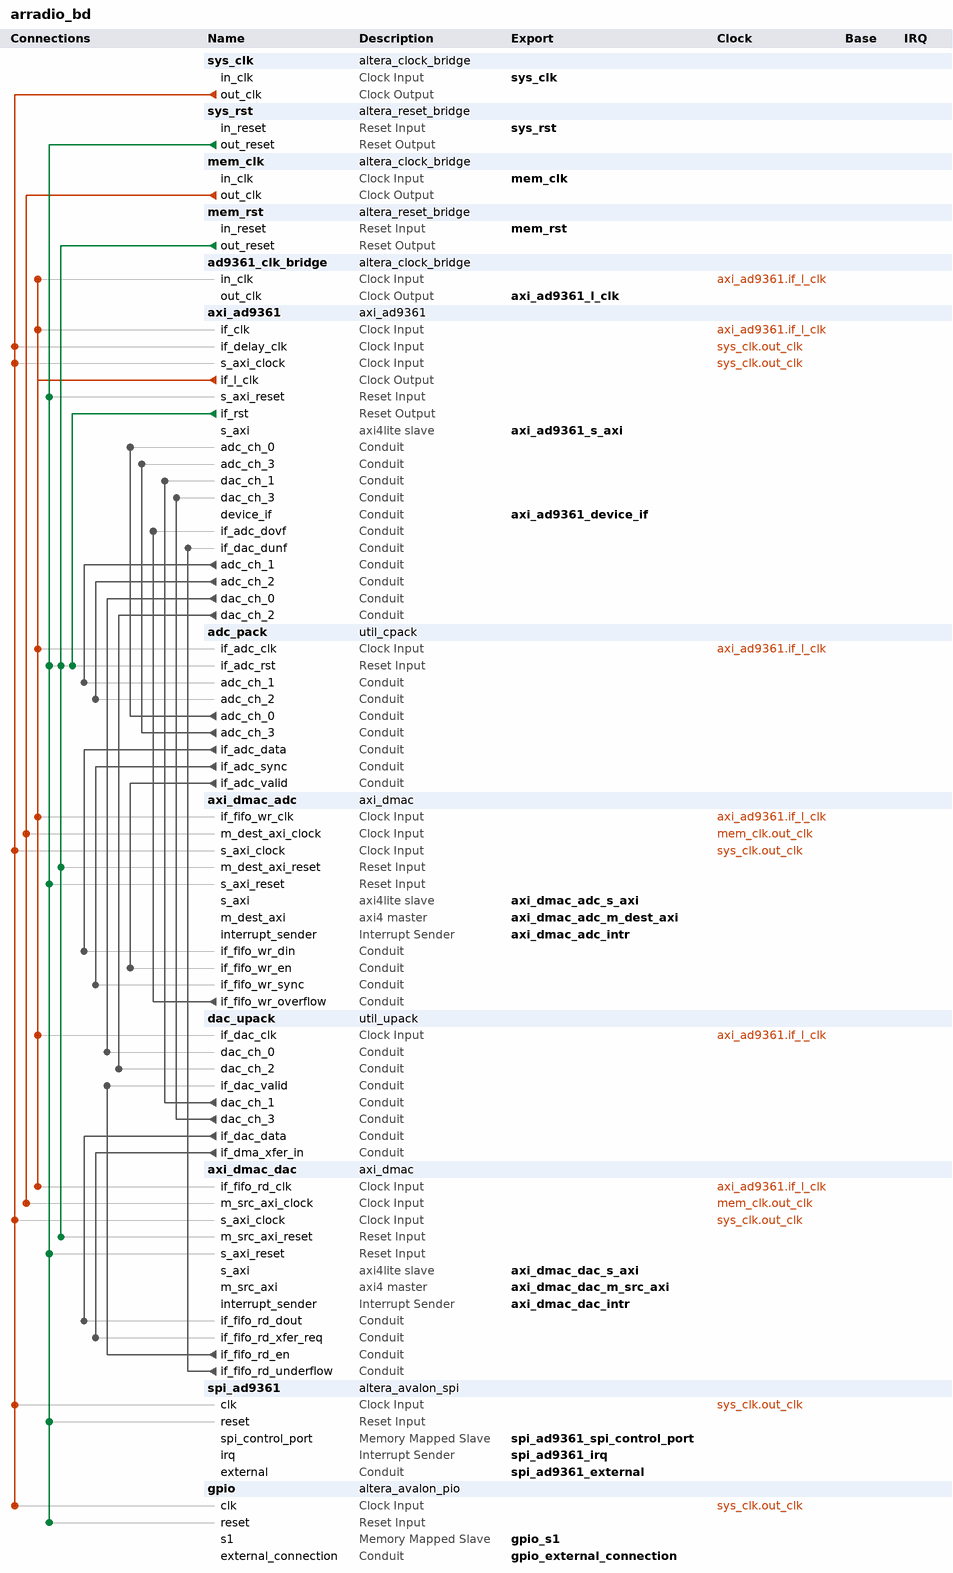
[diagram p0: system contents]
# Platform Designer (Qsys) system arradio_bd, Cyclone V 5CSXFC6D6F31C8ES
# Parameters at their usual value, and those the tool derives, are not listed.
package require -exact qsys 16.0
create_system arradio_bd
set_project_property DEVICE_FAMILY {Cyclone V}
set_project_property DEVICE 5CSXFC6D6F31C8ES

add_instance sys_clk altera_clock_bridge 16.0
set_instance_parameter_value sys_clk DERIVED_CLOCK_RATE 0
set_instance_parameter_value sys_clk EXPLICIT_CLOCK_RATE 50000000

add_instance sys_rst altera_reset_bridge 16.0
set_instance_parameter_value sys_rst ACTIVE_LOW_RESET 0
set_instance_parameter_value sys_rst SYNCHRONOUS_EDGES none

add_instance mem_clk altera_clock_bridge 16.0
set_instance_parameter_value mem_clk DERIVED_CLOCK_RATE 0
set_instance_parameter_value mem_clk EXPLICIT_CLOCK_RATE 0

add_instance mem_rst altera_reset_bridge 16.0
set_instance_parameter_value mem_rst ACTIVE_LOW_RESET 0
set_instance_parameter_value mem_rst SYNCHRONOUS_EDGES none

add_instance ad9361_clk_bridge altera_clock_bridge 16.0
set_instance_parameter_value ad9361_clk_bridge DERIVED_CLOCK_RATE 0
set_instance_parameter_value ad9361_clk_bridge EXPLICIT_CLOCK_RATE 0

add_instance axi_ad9361 axi_ad9361 1.0
set_instance_parameter_value axi_ad9361 ADC_DATAFORMAT_DISABLE 0
set_instance_parameter_value axi_ad9361 ADC_DATAPATH_DISABLE 0
set_instance_parameter_value axi_ad9361 ADC_DCFILTER_DISABLE 0
set_instance_parameter_value axi_ad9361 ADC_IQCORRECTION_DISABLE 0
set_instance_parameter_value axi_ad9361 ADC_USERPORTS_DISABLE 0
set_instance_parameter_value axi_ad9361 CMOS_OR_LVDS_N 0
set_instance_parameter_value axi_ad9361 DAC_DATAPATH_DISABLE 0
set_instance_parameter_value axi_ad9361 DAC_DDS_DISABLE 0
set_instance_parameter_value axi_ad9361 DAC_IODELAY_ENABLE 0
set_instance_parameter_value axi_ad9361 DAC_IQCORRECTION_DISABLE 0
set_instance_parameter_value axi_ad9361 DAC_USERPORTS_DISABLE 0
set_instance_parameter_value axi_ad9361 DEVICE_TYPE 0
set_instance_parameter_value axi_ad9361 ID 0
set_instance_parameter_value axi_ad9361 IO_DELAY_GROUP dev_if_delay_group
set_instance_parameter_value axi_ad9361 MODE_1R1T 0
set_instance_parameter_value axi_ad9361 TDD_DISABLE 0

add_instance adc_pack util_cpack 1.0
set_instance_parameter_value adc_pack CHANNEL_DATA_WIDTH 16
set_instance_parameter_value adc_pack NUM_OF_CHANNELS 4

add_instance axi_dmac_adc axi_dmac 1.0
set_instance_parameter_value axi_dmac_adc ASYNC_CLK_DEST_REQ 1
set_instance_parameter_value axi_dmac_adc ASYNC_CLK_REQ_SRC 1
set_instance_parameter_value axi_dmac_adc ASYNC_CLK_SRC_DEST 1
set_instance_parameter_value axi_dmac_adc AXI_SLICE_DEST 0
set_instance_parameter_value axi_dmac_adc AXI_SLICE_SRC 0
set_instance_parameter_value axi_dmac_adc CYCLIC 0
set_instance_parameter_value axi_dmac_adc DMA_2D_TRANSFER 0
set_instance_parameter_value axi_dmac_adc DMA_DATA_WIDTH_DEST 64
set_instance_parameter_value axi_dmac_adc DMA_DATA_WIDTH_SRC 64
set_instance_parameter_value axi_dmac_adc DMA_LENGTH_WIDTH 24
set_instance_parameter_value axi_dmac_adc DMA_TYPE_DEST 0
set_instance_parameter_value axi_dmac_adc DMA_TYPE_SRC 2
set_instance_parameter_value axi_dmac_adc FIFO_SIZE 4
set_instance_parameter_value axi_dmac_adc ID 0
set_instance_parameter_value axi_dmac_adc SYNC_TRANSFER_START 1

add_instance dac_upack util_upack 1.0
set_instance_parameter_value dac_upack CHANNEL_DATA_WIDTH 16
set_instance_parameter_value dac_upack NUM_OF_CHANNELS 4

add_instance axi_dmac_dac axi_dmac 1.0
set_instance_parameter_value axi_dmac_dac ASYNC_CLK_DEST_REQ 1
set_instance_parameter_value axi_dmac_dac ASYNC_CLK_REQ_SRC 1
set_instance_parameter_value axi_dmac_dac ASYNC_CLK_SRC_DEST 1
set_instance_parameter_value axi_dmac_dac AXI_SLICE_DEST 0
set_instance_parameter_value axi_dmac_dac AXI_SLICE_SRC 0
set_instance_parameter_value axi_dmac_dac CYCLIC 1
set_instance_parameter_value axi_dmac_dac DMA_2D_TRANSFER 0
set_instance_parameter_value axi_dmac_dac DMA_DATA_WIDTH_DEST 64
set_instance_parameter_value axi_dmac_dac DMA_DATA_WIDTH_SRC 64
set_instance_parameter_value axi_dmac_dac DMA_LENGTH_WIDTH 24
set_instance_parameter_value axi_dmac_dac DMA_TYPE_DEST 2
set_instance_parameter_value axi_dmac_dac DMA_TYPE_SRC 0
set_instance_parameter_value axi_dmac_dac FIFO_SIZE 4
set_instance_parameter_value axi_dmac_dac ID 0
set_instance_parameter_value axi_dmac_dac SYNC_TRANSFER_START 0

add_instance spi_ad9361 altera_avalon_spi 16.0
set_instance_parameter_value spi_ad9361 clockPolarity 1
set_instance_parameter_value spi_ad9361 dataWidth 8
set_instance_parameter_value spi_ad9361 masterSPI true
set_instance_parameter_value spi_ad9361 numberOfSlaves 1
set_instance_parameter_value spi_ad9361 targetClockRate 50000000

add_instance gpio altera_avalon_pio 16.0
set_instance_parameter_value gpio direction Output
set_instance_parameter_value gpio width 5

# connections
add_connection axi_ad9361.if_l_clk ad9361_clk_bridge.in_clk clock
add_connection axi_ad9361.if_l_clk adc_pack.if_adc_clk clock
add_connection axi_ad9361.if_l_clk axi_ad9361.if_clk clock
add_connection axi_ad9361.if_l_clk axi_dmac_adc.if_fifo_wr_clk clock
add_connection axi_ad9361.if_l_clk axi_dmac_dac.if_fifo_rd_clk clock
add_connection axi_ad9361.if_l_clk dac_upack.if_dac_clk clock
add_connection mem_clk.out_clk axi_dmac_adc.m_dest_axi_clock clock
add_connection mem_clk.out_clk axi_dmac_dac.m_src_axi_clock clock
add_connection sys_clk.out_clk axi_ad9361.if_delay_clk clock
add_connection sys_clk.out_clk axi_ad9361.s_axi_clock clock
add_connection sys_clk.out_clk axi_dmac_adc.s_axi_clock clock
add_connection sys_clk.out_clk axi_dmac_dac.s_axi_clock clock
add_connection sys_clk.out_clk gpio.clk clock
add_connection sys_clk.out_clk spi_ad9361.clk clock
add_connection axi_ad9361.if_rst adc_pack.if_adc_rst reset
add_connection mem_rst.out_reset adc_pack.if_adc_rst reset
add_connection mem_rst.out_reset axi_dmac_adc.m_dest_axi_reset reset
add_connection mem_rst.out_reset axi_dmac_dac.m_src_axi_reset reset
add_connection sys_rst.out_reset adc_pack.if_adc_rst reset
add_connection sys_rst.out_reset axi_ad9361.s_axi_reset reset
add_connection sys_rst.out_reset axi_dmac_adc.s_axi_reset reset
add_connection sys_rst.out_reset axi_dmac_dac.s_axi_reset reset
add_connection sys_rst.out_reset gpio.reset reset
add_connection sys_rst.out_reset spi_ad9361.reset reset
add_connection adc_pack.adc_ch_0 axi_ad9361.adc_ch_0 conduit
add_connection adc_pack.adc_ch_3 axi_ad9361.adc_ch_3 conduit
add_connection adc_pack.if_adc_data axi_dmac_adc.if_fifo_wr_din conduit
add_connection adc_pack.if_adc_sync axi_dmac_adc.if_fifo_wr_sync conduit
add_connection adc_pack.if_adc_valid axi_dmac_adc.if_fifo_wr_en conduit
add_connection axi_ad9361.adc_ch_1 adc_pack.adc_ch_1 conduit
add_connection axi_ad9361.adc_ch_2 adc_pack.adc_ch_2 conduit
add_connection axi_ad9361.dac_ch_0 dac_upack.dac_ch_0 conduit
add_connection axi_ad9361.dac_ch_2 dac_upack.dac_ch_2 conduit
add_connection axi_dmac_adc.if_fifo_wr_overflow axi_ad9361.if_adc_dovf conduit
add_connection axi_dmac_dac.if_fifo_rd_en dac_upack.if_dac_valid conduit
add_connection axi_dmac_dac.if_fifo_rd_underflow axi_ad9361.if_dac_dunf conduit
add_connection dac_upack.dac_ch_1 axi_ad9361.dac_ch_1 conduit
add_connection dac_upack.dac_ch_3 axi_ad9361.dac_ch_3 conduit
add_connection dac_upack.if_dac_data axi_dmac_dac.if_fifo_rd_dout conduit
add_connection dac_upack.if_dma_xfer_in axi_dmac_dac.if_fifo_rd_xfer_req conduit

# exported interfaces
add_interface axi_ad9361_device_if conduit end
set_interface_property axi_ad9361_device_if EXPORT_OF axi_ad9361.device_if
add_interface axi_ad9361_l_clk clock source
set_interface_property axi_ad9361_l_clk EXPORT_OF ad9361_clk_bridge.out_clk
add_interface axi_ad9361_s_axi axi4lite slave
set_interface_property axi_ad9361_s_axi EXPORT_OF axi_ad9361.s_axi
add_interface axi_dmac_adc_intr interrupt sender
set_interface_property axi_dmac_adc_intr EXPORT_OF axi_dmac_adc.interrupt_sender
add_interface axi_dmac_adc_m_dest_axi axi4 master
set_interface_property axi_dmac_adc_m_dest_axi EXPORT_OF axi_dmac_adc.m_dest_axi
add_interface axi_dmac_adc_s_axi axi4lite slave
set_interface_property axi_dmac_adc_s_axi EXPORT_OF axi_dmac_adc.s_axi
add_interface axi_dmac_dac_intr interrupt sender
set_interface_property axi_dmac_dac_intr EXPORT_OF axi_dmac_dac.interrupt_sender
add_interface axi_dmac_dac_m_src_axi axi4 master
set_interface_property axi_dmac_dac_m_src_axi EXPORT_OF axi_dmac_dac.m_src_axi
add_interface axi_dmac_dac_s_axi axi4lite slave
set_interface_property axi_dmac_dac_s_axi EXPORT_OF axi_dmac_dac.s_axi
add_interface gpio_external_connection conduit end
set_interface_property gpio_external_connection EXPORT_OF gpio.external_connection
add_interface gpio_s1 avalon slave
set_interface_property gpio_s1 EXPORT_OF gpio.s1
add_interface mem_clk clock sink
set_interface_property mem_clk EXPORT_OF mem_clk.in_clk
add_interface mem_rst reset sink
set_interface_property mem_rst EXPORT_OF mem_rst.in_reset
add_interface spi_ad9361_external conduit end
set_interface_property spi_ad9361_external EXPORT_OF spi_ad9361.external
add_interface spi_ad9361_irq interrupt sender
set_interface_property spi_ad9361_irq EXPORT_OF spi_ad9361.irq
add_interface spi_ad9361_spi_control_port avalon slave
set_interface_property spi_ad9361_spi_control_port EXPORT_OF spi_ad9361.spi_control_port
add_interface sys_clk clock sink
set_interface_property sys_clk EXPORT_OF sys_clk.in_clk
add_interface sys_rst reset sink
set_interface_property sys_rst EXPORT_OF sys_rst.in_reset

set_interconnect_requirement {$system} qsys_mm.clockCrossingAdapter FIFO
set_interconnect_requirement {$system} qsys_mm.maxAdditionalLatency 2
set_interconnect_requirement {mm_interconnect_0|cmd_mux} qsys_mm.postTransform.pipelineCount 0
set_interconnect_requirement {mm_interconnect_2|cmd_mux} qsys_mm.postTransform.pipelineCount 0
set_interconnect_requirement {mm_interconnect_3|cmd_mux} qsys_mm.postTransform.pipelineCount 0
set_interconnect_requirement {mm_interconnect_3|cmd_mux_001} qsys_mm.postTransform.pipelineCount 0
set_interconnect_requirement {mm_interconnect_4|axi_dmac_dac_m_src_axi_agent.write_cp/router.sink} qsys_mm.postTransform.pipelineCount 0
set_interconnect_requirement {mm_interconnect_4|cmd_mux} qsys_mm.postTransform.pipelineCount 0
set_interconnect_requirement {mm_interconnect_4|cmd_mux_001} qsys_mm.postTransform.pipelineCount 0

save_system arradio_bd.qsys
